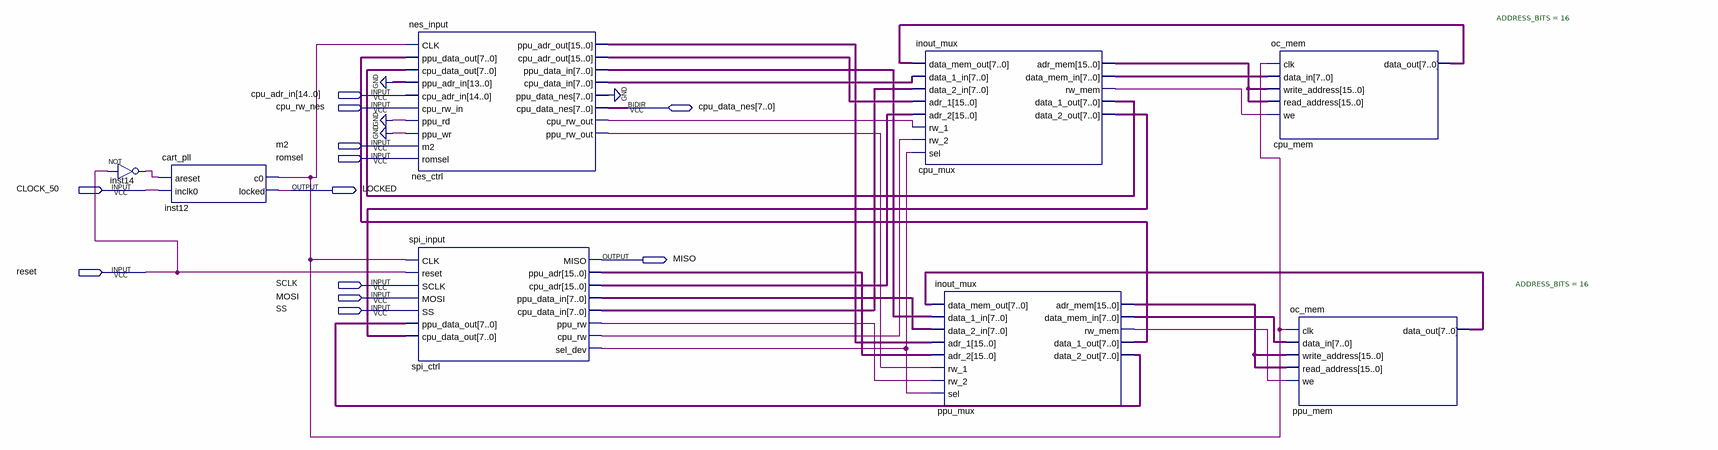
[diagram p0: schematic sheet]
// Quartus schematic Cartridge_FPGA.bdf as structural Verilog: 8 symbols, 12 pins
module Cartridge_FPGA (
  input  [14:0] cpu_adr_in,
  input  cpu_rw_nes,
  input  m2,
  input  romsel,
  input  CLOCK_50,
  input  reset,
  input  SCLK,
  input  MOSI,
  input  SS,
  inout  [7:0] cpu_data_nes,
  output LOCKED,
  output MISO
);

  wire cpu_mux_rw_mem, inst12_c0, inst14_out, nes_ctrl_cpu_rw_out, nes_ctrl_ppu_rw_out, ppu_mux_rw_mem,
       spi_ctrl_cpu_rw, spi_ctrl_ppu_rw, spi_ctrl_sel_dev;
  wire [7:0] cpu_mem_data_out, cpu_mux_data_1_out, cpu_mux_data_2_out, cpu_mux_data_mem_in,
       nes_ctrl_cpu_data_in, nes_ctrl_ppu_data_in, nes_ctrl_ppu_data_nes, ppu_mem_data_out,
       ppu_mux_data_1_out, ppu_mux_data_2_out, ppu_mux_data_mem_in, spi_ctrl_cpu_data_in,
       spi_ctrl_ppu_data_in;
  wire [15:0] cpu_mux_adr_mem, nes_ctrl_cpu_adr_out, nes_ctrl_ppu_adr_out, ppu_mux_adr_mem, spi_ctrl_cpu_adr,
       spi_ctrl_ppu_adr;

  not inst14 (inst14_out, reset);
  cart_pll inst12 (.areset(inst14_out), .inclk0(CLOCK_50), .c0(inst12_c0), .locked(LOCKED));
  nes_input nes_ctrl (
    .CLK(inst12_c0), .ppu_data_out(ppu_mux_data_1_out), .cpu_data_out(cpu_mux_data_1_out),
    .ppu_adr_in({14{1'b0}}), .cpu_adr_in(cpu_adr_in), .cpu_rw_in(cpu_rw_nes), .ppu_rd(1'b0), .ppu_wr(1'b0),
    .m2(m2), .romsel(romsel), .ppu_adr_out(nes_ctrl_ppu_adr_out), .cpu_adr_out(nes_ctrl_cpu_adr_out),
    .ppu_data_in(nes_ctrl_ppu_data_in), .cpu_data_in(nes_ctrl_cpu_data_in), .cpu_rw_out(nes_ctrl_cpu_rw_out),
    .ppu_rw_out(nes_ctrl_ppu_rw_out), .ppu_data_nes(nes_ctrl_ppu_data_nes), .cpu_data_nes(cpu_data_nes));
  spi_input spi_ctrl (
    .CLK(inst12_c0), .reset(reset), .SCLK(SCLK), .MOSI(MOSI), .SS(SS), .ppu_data_out(ppu_mux_data_2_out),
    .cpu_data_out(cpu_mux_data_2_out), .MISO(MISO), .ppu_adr(spi_ctrl_ppu_adr), .cpu_adr(spi_ctrl_cpu_adr),
    .ppu_data_in(spi_ctrl_ppu_data_in), .cpu_data_in(spi_ctrl_cpu_data_in), .ppu_rw(spi_ctrl_ppu_rw),
    .cpu_rw(spi_ctrl_cpu_rw), .sel_dev(spi_ctrl_sel_dev));
  inout_mux cpu_mux (
    .data_mem_out(cpu_mem_data_out), .data_1_in(nes_ctrl_cpu_data_in), .data_2_in(spi_ctrl_cpu_data_in),
    .adr_1(nes_ctrl_cpu_adr_out), .adr_2(spi_ctrl_cpu_adr), .rw_1(nes_ctrl_cpu_rw_out),
    .rw_2(spi_ctrl_cpu_rw), .sel(spi_ctrl_sel_dev), .adr_mem(cpu_mux_adr_mem),
    .data_mem_in(cpu_mux_data_mem_in), .rw_mem(cpu_mux_rw_mem), .data_1_out(cpu_mux_data_1_out),
    .data_2_out(cpu_mux_data_2_out));
  inout_mux ppu_mux (
    .data_mem_out(ppu_mem_data_out), .data_1_in(nes_ctrl_ppu_data_in), .data_2_in(spi_ctrl_ppu_data_in),
    .adr_1(nes_ctrl_ppu_adr_out), .adr_2(spi_ctrl_ppu_adr), .rw_1(nes_ctrl_ppu_rw_out),
    .rw_2(spi_ctrl_ppu_rw), .sel(spi_ctrl_sel_dev), .adr_mem(ppu_mux_adr_mem),
    .data_mem_in(ppu_mux_data_mem_in), .rw_mem(ppu_mux_rw_mem), .data_1_out(ppu_mux_data_1_out),
    .data_2_out(ppu_mux_data_2_out));
  oc_mem #(.ADDRESS_BITS(16)) cpu_mem (
    .clk(inst12_c0), .data_in(cpu_mux_data_mem_in), .write_address(cpu_mux_adr_mem),
    .read_address(cpu_mux_adr_mem), .we(cpu_mux_rw_mem), .data_out(cpu_mem_data_out));
  oc_mem #(.ADDRESS_BITS(16)) ppu_mem (
    .clk(inst12_c0), .data_in(ppu_mux_data_mem_in), .write_address(ppu_mux_adr_mem),
    .read_address(ppu_mux_adr_mem), .we(ppu_mux_rw_mem), .data_out(ppu_mem_data_out));
  // also tied to GND on the sheet: {nes_ctrl_ppu_data_nes[0], nes_ctrl_ppu_data_nes[1], nes_ctrl_ppu_data_nes[2], nes_ctrl_ppu_data_nes[3], nes_ctrl_ppu_data_nes[4], nes_ctrl_ppu_data_nes[5], nes_ctrl_ppu_data_nes[6], nes_ctrl_ppu_data_nes[7]}
endmodule
